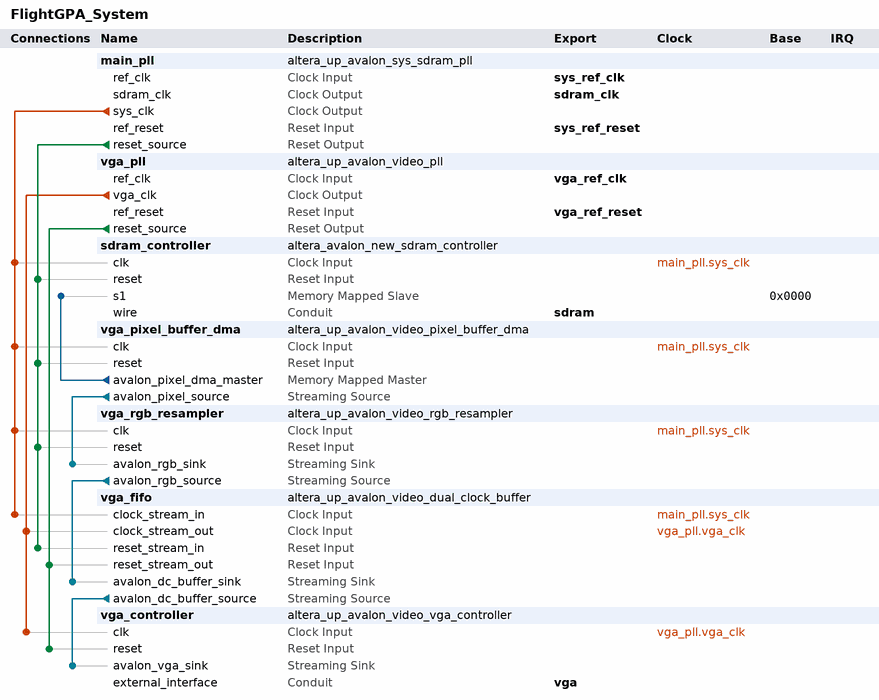
[diagram p0: system contents]
# Platform Designer (Qsys) system FlightGPA_System, Cyclone V 5CSEMA5F31C6
# Parameters at their usual value, and those the tool derives, are not listed.
package require -exact qsys 18.0
create_system FlightGPA_System
set_project_property DEVICE_FAMILY {Cyclone V}
set_project_property DEVICE 5CSEMA5F31C6

add_instance main_pll altera_up_avalon_sys_sdram_pll 18.0
set_instance_parameter_value main_pll CV_boards DE1-SoC
set_instance_parameter_value main_pll gui_outclk 50.0
set_instance_parameter_value main_pll gui_refclk 50.0

add_instance vga_pll altera_up_avalon_video_pll 18.0
set_instance_parameter_value vga_pll camera {5MP Digital Camera (THDB_D5M)}
set_instance_parameter_value vga_pll gui_refclk 50.0
set_instance_parameter_value vga_pll lcd {7" LCD on VEEK-MT and MTL/MTL2 Modules}

add_instance sdram_controller altera_avalon_new_sdram_controller 18.1
set_instance_parameter_value sdram_controller TAC 5.5
set_instance_parameter_value sdram_controller TRCD 20.0
set_instance_parameter_value sdram_controller TRP 20.0
set_instance_parameter_value sdram_controller casLatency 3
set_instance_parameter_value sdram_controller columnWidth 10
set_instance_parameter_value sdram_controller dataWidth 16
set_instance_parameter_value sdram_controller generateSimulationModel true
set_instance_parameter_value sdram_controller model single_Micron_MT48LC4M32B2_7_chip
set_instance_parameter_value sdram_controller numberOfBanks 4
set_instance_parameter_value sdram_controller numberOfChipSelects 1
set_instance_parameter_value sdram_controller powerUpDelay 100.0
set_instance_parameter_value sdram_controller refreshPeriod 15.625
set_instance_parameter_value sdram_controller rowWidth 13

add_instance vga_pixel_buffer_dma altera_up_avalon_video_pixel_buffer_dma 18.0
set_instance_parameter_value vga_pixel_buffer_dma addr_mode Consecutive
set_instance_parameter_value vga_pixel_buffer_dma back_start_address 0
set_instance_parameter_value vga_pixel_buffer_dma color_space {8-bit RGB}
set_instance_parameter_value vga_pixel_buffer_dma image_height 480
set_instance_parameter_value vga_pixel_buffer_dma image_width 640
set_instance_parameter_value vga_pixel_buffer_dma start_address 0

add_instance vga_rgb_resampler altera_up_avalon_video_rgb_resampler 18.0
set_instance_parameter_value vga_rgb_resampler alpha 1023
set_instance_parameter_value vga_rgb_resampler input_type {8-bit RGB}
set_instance_parameter_value vga_rgb_resampler output_type {30-bit RGB}

add_instance vga_fifo altera_up_avalon_video_dual_clock_buffer 18.0
set_instance_parameter_value vga_fifo color_bits 10

add_instance vga_controller altera_up_avalon_video_vga_controller 18.0
set_instance_parameter_value vga_controller board DE1-SoC
set_instance_parameter_value vga_controller resolution {VGA 640x480}

# connections
add_connection main_pll.sys_clk sdram_controller.clk clock
add_connection main_pll.sys_clk vga_fifo.clock_stream_in clock
add_connection main_pll.sys_clk vga_pixel_buffer_dma.clk clock
add_connection main_pll.sys_clk vga_rgb_resampler.clk clock
add_connection vga_pll.vga_clk vga_controller.clk clock
add_connection vga_pll.vga_clk vga_fifo.clock_stream_out clock
add_connection main_pll.reset_source sdram_controller.reset reset
add_connection main_pll.reset_source vga_fifo.reset_stream_in reset
add_connection main_pll.reset_source vga_pixel_buffer_dma.reset reset
add_connection main_pll.reset_source vga_rgb_resampler.reset reset
add_connection vga_pll.reset_source vga_controller.reset reset
add_connection vga_pll.reset_source vga_fifo.reset_stream_out reset
add_connection vga_pixel_buffer_dma.avalon_pixel_dma_master sdram_controller.s1 avalon
set_connection_parameter_value vga_pixel_buffer_dma.avalon_pixel_dma_master/sdram_controller.s1 baseAddress 0x0000
add_connection vga_fifo.avalon_dc_buffer_source vga_controller.avalon_vga_sink avalon_streaming
add_connection vga_pixel_buffer_dma.avalon_pixel_source vga_rgb_resampler.avalon_rgb_sink avalon_streaming
add_connection vga_rgb_resampler.avalon_rgb_source vga_fifo.avalon_dc_buffer_sink avalon_streaming

# exported interfaces
add_interface sdram conduit end
set_interface_property sdram EXPORT_OF sdram_controller.wire
add_interface sdram_clk clock source
set_interface_property sdram_clk EXPORT_OF main_pll.sdram_clk
add_interface sys_ref_clk clock sink
set_interface_property sys_ref_clk EXPORT_OF main_pll.ref_clk
add_interface sys_ref_reset reset sink
set_interface_property sys_ref_reset EXPORT_OF main_pll.ref_reset
add_interface vga conduit end
set_interface_property vga EXPORT_OF vga_controller.external_interface
add_interface vga_ref_clk clock sink
set_interface_property vga_ref_clk EXPORT_OF vga_pll.ref_clk
add_interface vga_ref_reset reset sink
set_interface_property vga_ref_reset EXPORT_OF vga_pll.ref_reset

set_interconnect_requirement {$system} qsys_mm.clockCrossingAdapter HANDSHAKE
set_interconnect_requirement {$system} qsys_mm.enableEccProtection FALSE
set_interconnect_requirement {$system} qsys_mm.insertDefaultSlave FALSE
set_interconnect_requirement {$system} qsys_mm.maxAdditionalLatency 1

save_system FlightGPA_System.qsys
